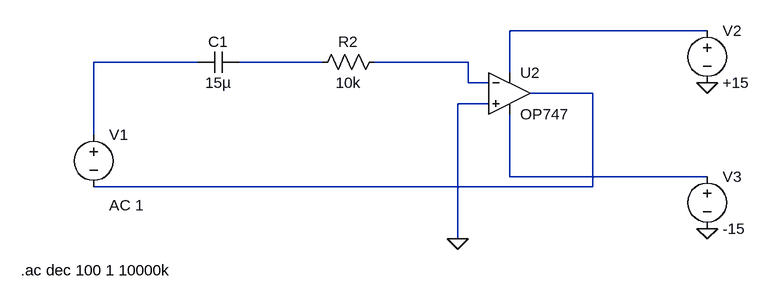
[diagram p0: schematic active_highPass1.asc]
active_highPass1.asc, the LTspice schematic file:
Version 4
SHEET 1 1096 680
WIRE 960 80 656 80
WIRE 176 128 16 128
WIRE 368 128 240 128
WIRE 592 128 448 128
WIRE 656 144 656 80
WIRE 592 160 592 128
WIRE 624 160 592 160
WIRE 784 176 688 176
WIRE 624 192 576 192
WIRE 16 240 16 128
WIRE 656 304 656 208
WIRE 960 304 656 304
WIRE 784 320 784 176
WIRE 784 320 16 320
WIRE 576 400 576 192
FLAG 960 384 0
FLAG 960 160 0
FLAG 576 400 0
SYMBOL res 464 112 R90
WINDOW 0 0 56 VBottom 2
WINDOW 3 32 56 VTop 2
SYMATTR InstName R2
SYMATTR Value 10k
SYMBOL cap 240 112 R90
WINDOW 0 0 32 VBottom 2
WINDOW 3 32 32 VTop 2
SYMATTR InstName C1
SYMATTR Value 15µ
SYMBOL voltage 16 224 R0
WINDOW 123 24 124 Left 2
WINDOW 39 0 0 Left 0
SYMATTR Value2 AC 1
SYMATTR InstName V1
SYMATTR Value ""
SYMBOL voltage 960 64 R0
WINDOW 123 0 0 Left 0
WINDOW 39 0 0 Left 0
SYMATTR InstName V2
SYMATTR Value +15
SYMBOL voltage 960 288 R0
WINDOW 123 0 0 Left 0
WINDOW 39 0 0 Left 0
SYMATTR InstName V3
SYMATTR Value -15
SYMBOL OpAmps\\OP747 656 112 R0
SYMATTR InstName U2
TEXT -96 448 Left 2 !.ac dec 100 1 10000k

The netlist it stands for:
* active_highPass1.asc
R2 N004 N003 10k
C1 N003 N002 15µ
V1 N002 N005 AC 1
V2 N001 0 +15
V3 N006 0 -15
XU2 0 N004 N001 N006 N005 OP747  ; pins In+ In- V+ V- OUT
.ac dec 100 1 10000k
.backanno
.end